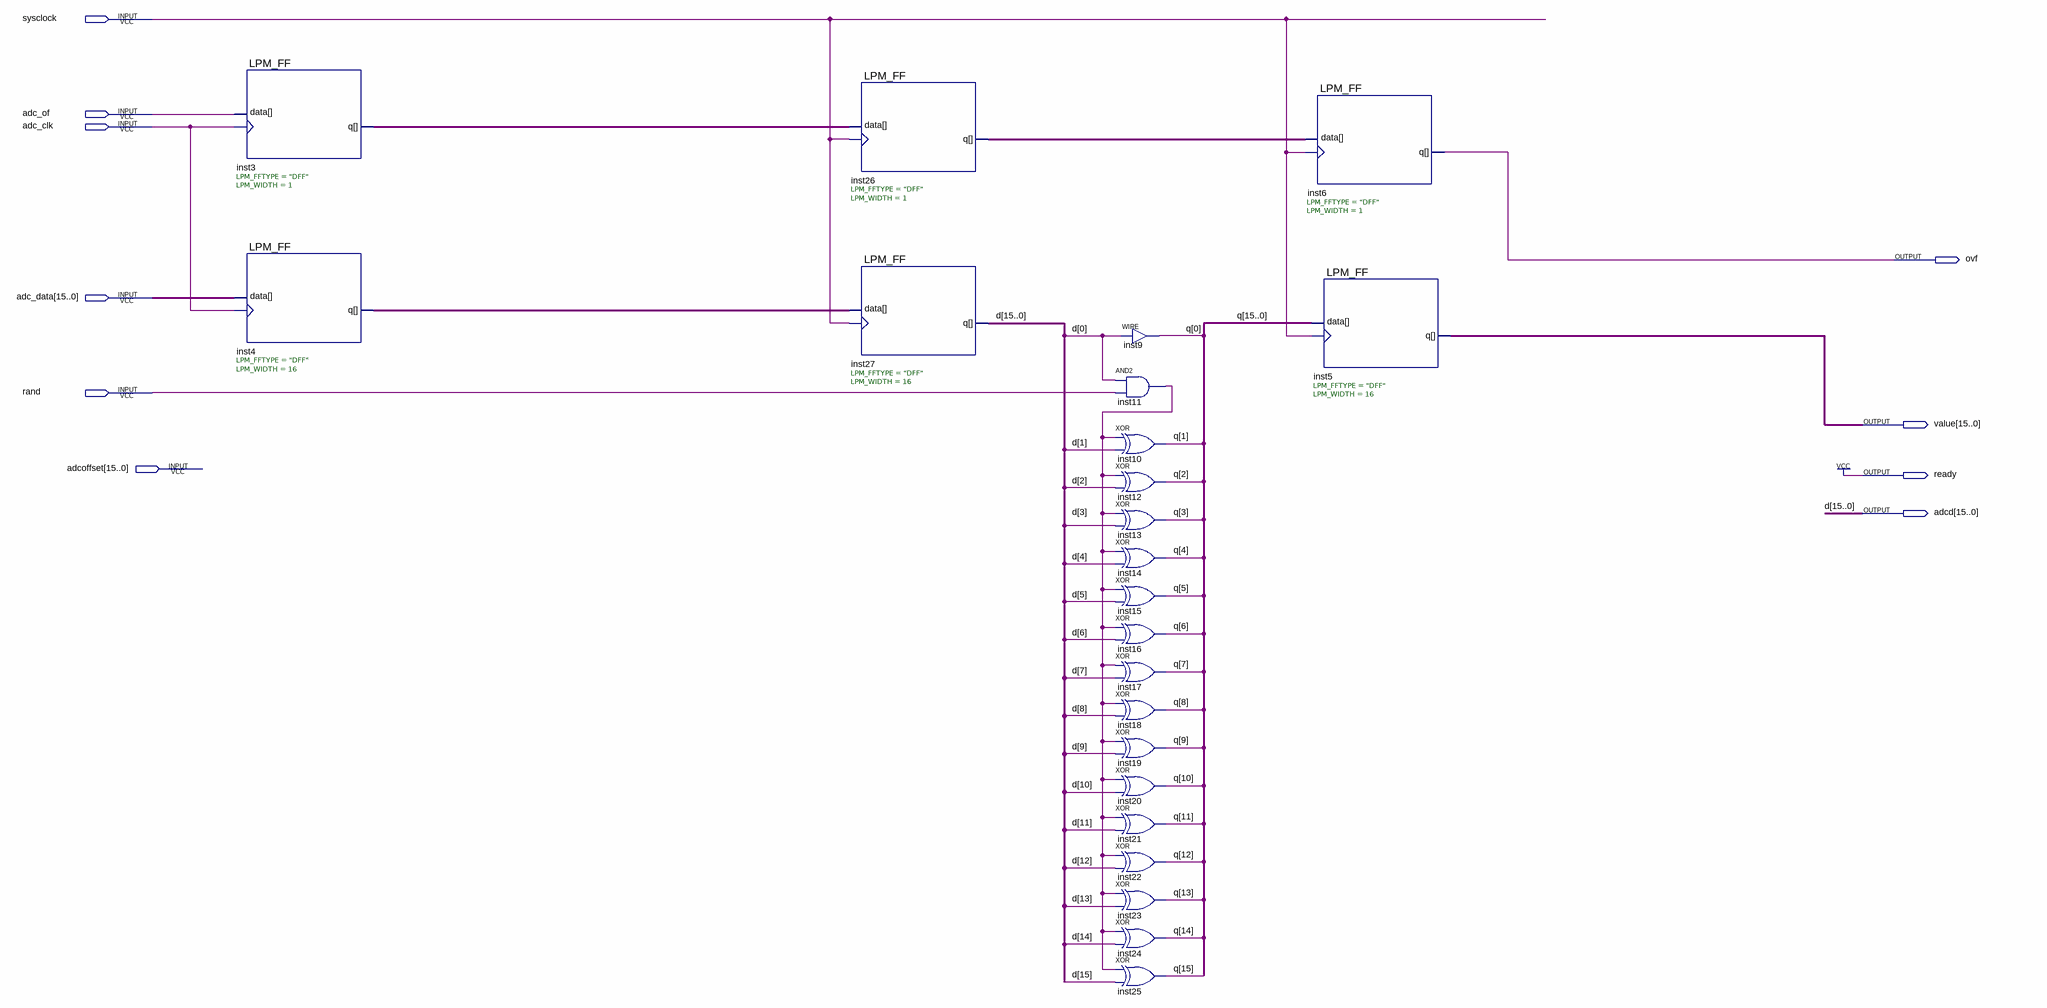
[diagram p0: schematic sheet]
// Quartus schematic LTC2208_input.bdf as structural Verilog: 23 symbols, 10 pins
module LTC2208_input (
  input  sysclock,
  input  adc_of,
  input  adc_clk,
  input  [15:0] adc_data,
  input  \rand ,
  input  [15:0] adcoffset,
  output ovf,
  output [15:0] value,
  output ready,
  output [15:0] adcd
);

  wire inst3_q, inst11_out, inst26_q;
  wire [15:0] inst4_q, q;

  LPM_FF #(.LPM_FFTYPE("DFF"), .LPM_WIDTH(1)) inst3 (.clock(adc_clk), .data(adc_of), .q(inst3_q));
  LPM_FF #(.LPM_FFTYPE("DFF"), .LPM_WIDTH(16)) inst4 (.clock(adc_clk), .data(adc_data), .q(inst4_q));
  LPM_FF #(.LPM_FFTYPE("DFF"), .LPM_WIDTH(1)) inst26 (.clock(sysclock), .data(inst3_q), .q(inst26_q));
  LPM_FF #(.LPM_FFTYPE("DFF"), .LPM_WIDTH(16)) inst27 (.clock(sysclock), .data(inst4_q), .q(adcd));
  assign q[0] = adcd[0];  // WIRE inst9
  and inst11 (inst11_out, adcd[0], \rand );
  xor inst10 (q[1], inst11_out, adcd[1]);
  xor inst12 (q[2], inst11_out, adcd[2]);
  xor inst13 (q[3], inst11_out, adcd[3]);
  xor inst14 (q[4], inst11_out, adcd[4]);
  xor inst15 (q[5], inst11_out, adcd[5]);
  xor inst16 (q[6], inst11_out, adcd[6]);
  xor inst17 (q[7], inst11_out, adcd[7]);
  xor inst18 (q[8], inst11_out, adcd[8]);
  xor inst19 (q[9], inst11_out, adcd[9]);
  xor inst20 (q[10], inst11_out, adcd[10]);
  xor inst21 (q[11], inst11_out, adcd[11]);
  xor inst22 (q[12], inst11_out, adcd[12]);
  xor inst23 (q[13], inst11_out, adcd[13]);
  xor inst24 (q[14], inst11_out, adcd[14]);
  xor inst25 (q[15], inst11_out, adcd[15]);
  LPM_FF #(.LPM_FFTYPE("DFF"), .LPM_WIDTH(1)) inst6 (.clock(sysclock), .data(inst26_q), .q(ovf));
  LPM_FF #(.LPM_FFTYPE("DFF"), .LPM_WIDTH(16)) inst5 (.clock(sysclock), .data(q), .q(value));

  assign ready = 1'b1;

  // Other names for the same wires on the sheet: d[15:0] = adcd
endmodule
